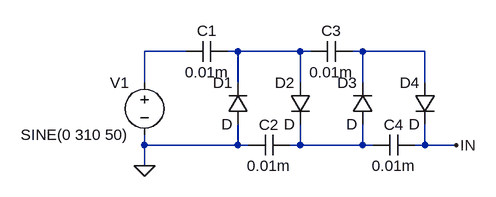
[diagram p0: schematic multiplier.asc]
multiplier.asc, the LTspice schematic file:
Version 4
SHEET 1 880 680
WIRE -208 -672 -272 -672
WIRE -128 -672 -144 -672
WIRE -32 -672 -128 -672
WIRE -16 -672 -32 -672
WIRE 64 -672 48 -672
WIRE 160 -672 64 -672
WIRE -272 -624 -272 -672
WIRE -128 -624 -128 -672
WIRE -32 -624 -32 -672
WIRE 64 -624 64 -672
WIRE 160 -624 160 -672
WIRE -272 -528 -272 -544
WIRE -128 -528 -128 -560
WIRE -128 -528 -272 -528
WIRE -112 -528 -128 -528
WIRE -32 -528 -32 -560
WIRE -32 -528 -48 -528
WIRE 64 -528 64 -560
WIRE 64 -528 -32 -528
WIRE 80 -528 64 -528
WIRE 160 -528 160 -560
WIRE 160 -528 144 -528
WIRE 208 -528 160 -528
WIRE -272 -496 -272 -528
FLAG -272 -496 0
FLAG 208 -528 IN
SYMBOL voltage -272 -640 M0
WINDOW 123 0 0 Left 0
WINDOW 39 0 0 Left 0
SYMATTR InstName V1
SYMATTR Value SINE(0 310 50)
SYMBOL cap 48 -688 R90
WINDOW 0 0 32 VBottom 2
WINDOW 3 32 32 VTop 2
SYMATTR InstName C3
SYMATTR Value 0.01m
SYMBOL cap -144 -688 R90
WINDOW 0 0 32 VBottom 2
WINDOW 3 32 32 VTop 2
SYMATTR InstName C1
SYMATTR Value 0.01m
SYMBOL cap -48 -544 R90
WINDOW 0 0 32 VBottom 2
WINDOW 3 32 32 VTop 2
SYMATTR InstName C2
SYMATTR Value 0.01m
SYMBOL cap 144 -544 R90
WINDOW 0 0 32 VBottom 2
WINDOW 3 32 32 VTop 2
SYMATTR InstName C4
SYMATTR Value 0.01m
SYMBOL diode -112 -560 R180
WINDOW 0 24 64 Left 2
WINDOW 3 24 0 Left 2
SYMATTR InstName D1
SYMBOL diode -16 -624 M0
SYMATTR InstName D2
SYMBOL diode 80 -560 R180
WINDOW 0 24 64 Left 2
WINDOW 3 24 0 Left 2
SYMATTR InstName D3
SYMBOL diode 176 -624 M0
SYMATTR InstName D4

The netlist it stands for:
* multiplier.asc
V1 N001 0 SINE(0 310 50)
C3 N003 N002 0.01m
C1 N002 N001 0.01m
C2 N004 0 0.01m
C4 IN N004 0.01m
D1 0 N002 D
D2 N002 N004 D
D3 N004 N003 D
D4 N003 IN D
.model D D
.lib standard.dio
.backanno
.end